# Altium schematic sheet Banks_13_14.SchDoc: FPGA Motherboard for Digital Multiplexed Readout, McGill U.
size B; DocumentNumber: DfMUX8; Revision: Rev0, Prototype; SheetNumber: 8; SheetTotal: 27; PageSetup: Record=PageOptions|CenterHorizontal=True|CenterVertical=True|PrintScale=1.08|XCorrection=1.00|YCorrection=1.00|PrintKind=0|BorderSize=5000000|LeftOffset=0|BottomOffset=0|Orientation=2|PaperLength=1000|PaperWidth=1000|Scale=100|PaperSource=7|PrintQuality=-4|MediaType=1|DitherType=10|PaperKind=Tabloid|PrintScaleMode=1
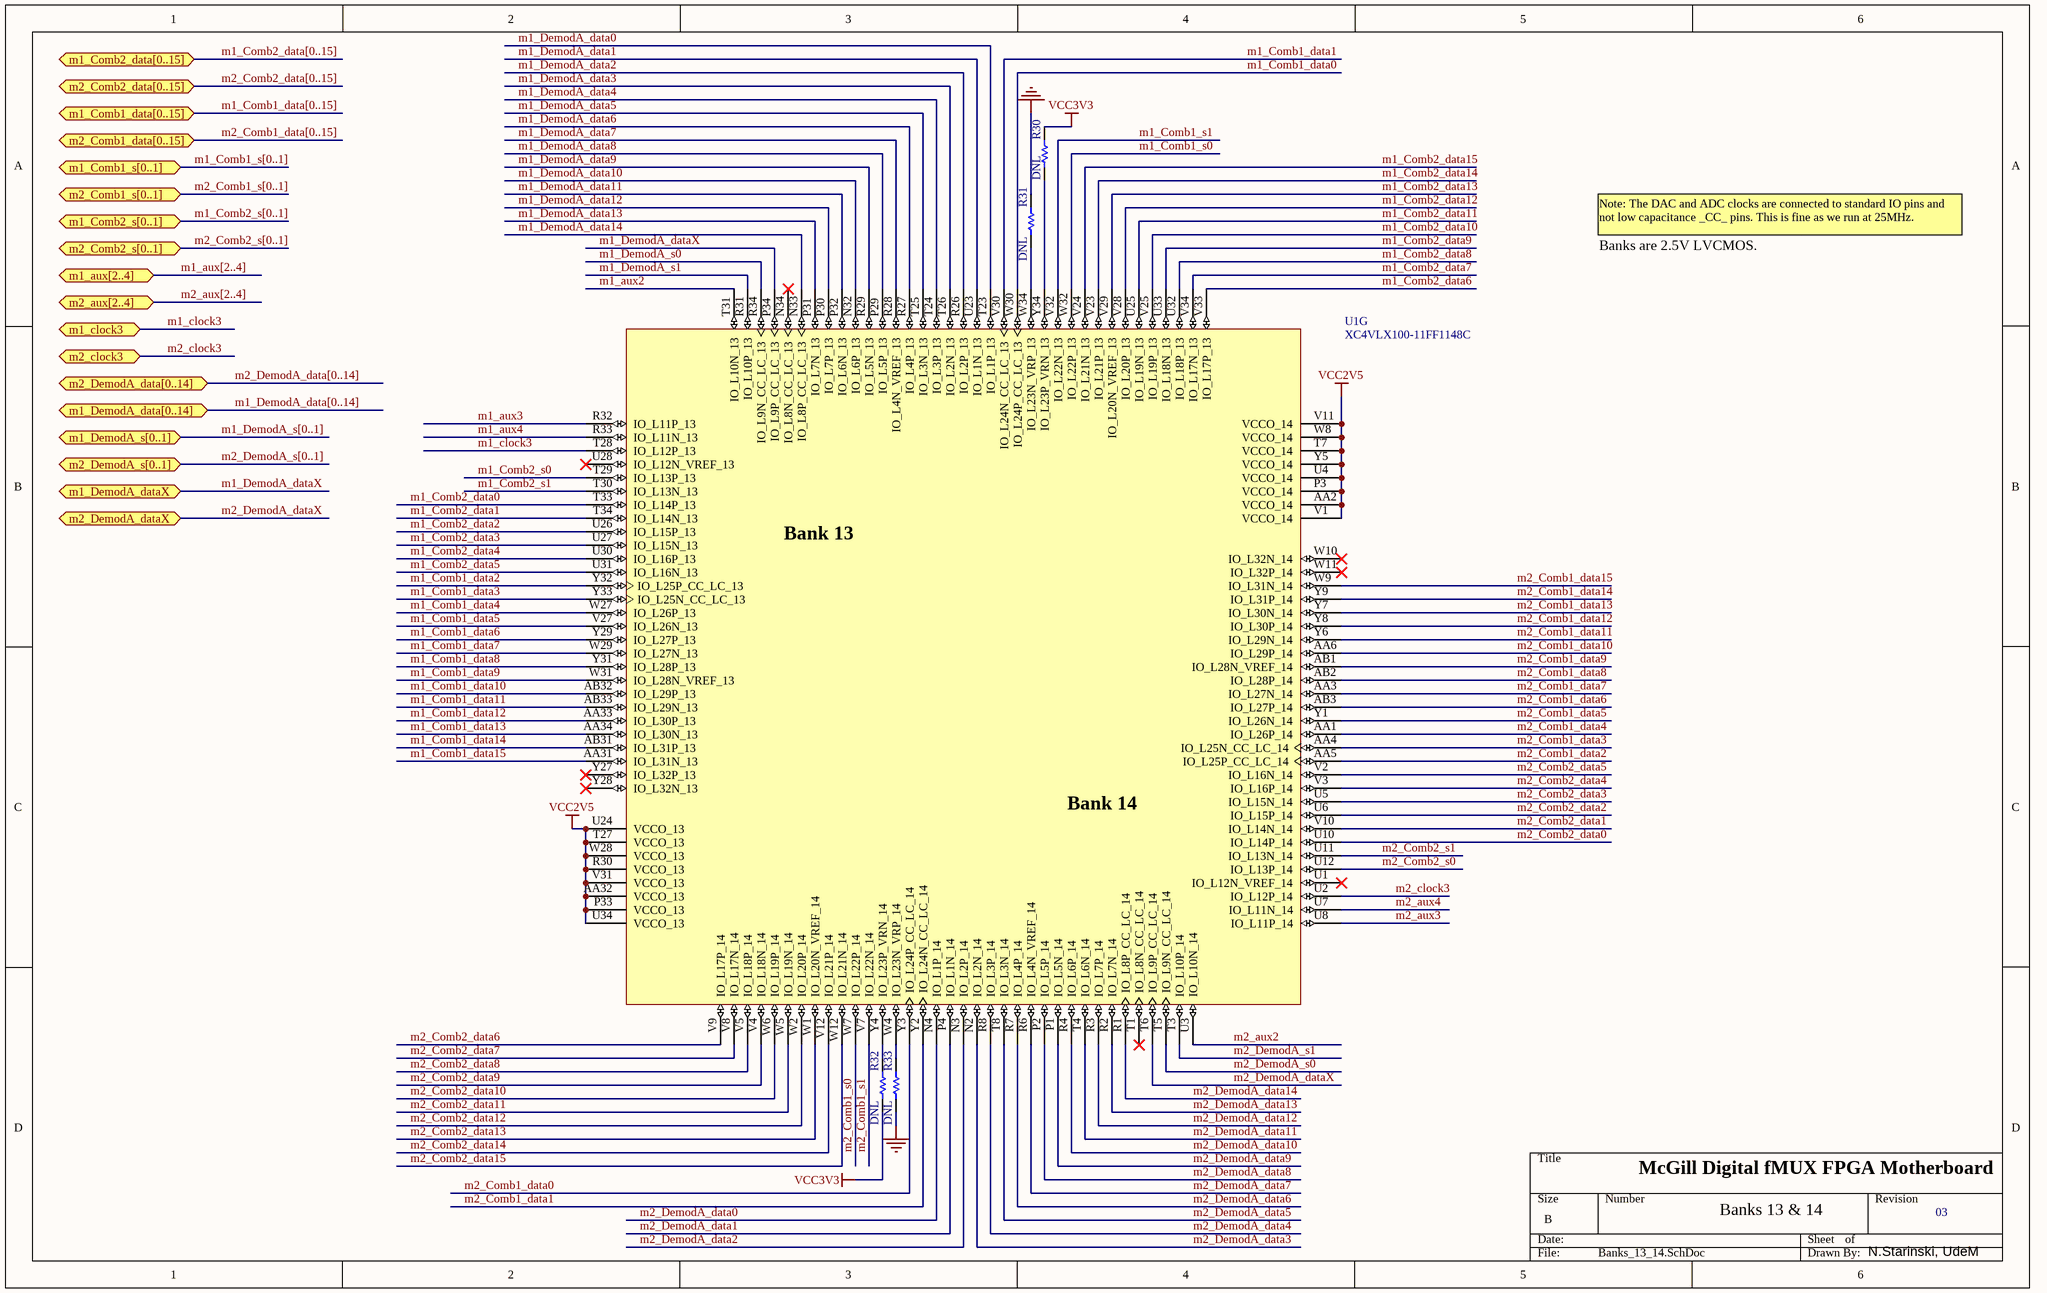
[diagram p0: Banks_13_14.SchDoc]

## Parts
R30  DNL  [CR1608-0603]
R31  DNL  [CR1608-0603]
R32  DNL  [CR1608-0603]
R33  DNL  [CR1608-0603]
U1  XC4VLX100-11FF1148C  [FF1148]  (part G of 10)

## Ports
m1_aux[2..4] (bidir), m1_clock3 (bidir), m1_Comb1_data[0..15] (bidir), m1_Comb1_s[0..1] (bidir), m1_Comb2_data[0..15] (bidir), m1_Comb2_s[0..1] (bidir), m1_DemodA_data[0..14] (bidir), m1_DemodA_dataX (bidir), m1_DemodA_s[0..1] (bidir), m2_aux[2..4] (bidir), m2_clock3 (bidir), m2_Comb1_data[0..15] (bidir), m2_Comb1_s[0..1] (bidir), m2_Comb2_data[0..15] (bidir), m2_Comb2_s[0..1] (bidir), m2_DemodA_data[0..14] (bidir), m2_DemodA_dataX (bidir), m2_DemodA_s[0..1] (bidir)

## Nets
GND: R31.2 R33.1
VCC2V5: U1.AA2(VCCO_14) U1.AA32(VCCO_13) U1.P3(VCCO_14) U1.P33(VCCO_13) U1.R30(VCCO_13) U1.T7(VCCO_14) U1.T27(VCCO_13) U1.U4(VCCO_14) U1.U24(VCCO_13) U1.U34(VCCO_13) U1.V1(VCCO_14) U1.V11(VCCO_14) U1.V31(VCCO_13) U1.W8(VCCO_14) U1.W28(VCCO_13) U1.Y5(VCCO_14)
VCC3V3: R30.2 R32.1
m1_aux2: U1.T31(IO_L10N_13)
m1_aux3: U1.R32(IO_L11P_13)
m1_aux4: U1.R33(IO_L11N_13)
m1_clock3: U1.T28(IO_L12P_13) ; port m1_clock3
m1_Comb1_data0: U1.W30(IO_L24P_CC_LC_13)
m1_Comb1_data1: U1.V30(IO_L24N_CC_LC_13)
m1_Comb1_data2: U1.Y32(IO_L25P_CC_LC_13)
m1_Comb1_data3: U1.Y33(IO_L25N_CC_LC_13)
m1_Comb1_data4: U1.W27(IO_L26P_13)
m1_Comb1_data5: U1.V27(IO_L26N_13)
m1_Comb1_data6: U1.Y29(IO_L27P_13)
m1_Comb1_data7: U1.W29(IO_L27N_13)
m1_Comb1_data8: U1.Y31(IO_L28P_13)
m1_Comb1_data9: U1.W31(IO_L28N_VREF_13)
m1_Comb1_data10: U1.AB32(IO_L29P_13)
m1_Comb1_data11: U1.AB33(IO_L29N_13)
m1_Comb1_data12: U1.AA33(IO_L30P_13)
m1_Comb1_data13: U1.AA34(IO_L30N_13)
m1_Comb1_data14: U1.AB31(IO_L31P_13)
m1_Comb1_data15: U1.AA31(IO_L31N_13)
m1_Comb1_s0: U1.W32(IO_L22P_13)
m1_Comb1_s1: U1.V32(IO_L22N_13)
m1_Comb2_data0: U1.T33(IO_L14P_13)
m1_Comb2_data1: U1.T34(IO_L14N_13)
m1_Comb2_data2: U1.U26(IO_L15P_13)
m1_Comb2_data3: U1.U27(IO_L15N_13)
m1_Comb2_data4: U1.U30(IO_L16P_13)
m1_Comb2_data5: U1.U31(IO_L16N_13)
m1_Comb2_data6: U1.V33(IO_L17P_13)
m1_Comb2_data7: U1.V34(IO_L17N_13)
m1_Comb2_data8: U1.U32(IO_L18P_13)
m1_Comb2_data9: U1.U33(IO_L18N_13)
m1_Comb2_data10: U1.V25(IO_L19P_13)
m1_Comb2_data11: U1.U25(IO_L19N_13)
m1_Comb2_data12: U1.V28(IO_L20P_13)
m1_Comb2_data13: U1.V29(IO_L20N_VREF_13)
m1_Comb2_data14: U1.V23(IO_L21P_13)
m1_Comb2_data15: U1.V24(IO_L21N_13)
m1_Comb2_s0: U1.T29(IO_L13P_13)
m1_Comb2_s1: U1.T30(IO_L13N_13)
m1_DemodA_data0: U1.T23(IO_L1P_13)
m1_DemodA_data1: U1.U23(IO_L1N_13)
m1_DemodA_data2: U1.R26(IO_L2P_13)
m1_DemodA_data3: U1.T26(IO_L2N_13)
m1_DemodA_data4: U1.T24(IO_L3P_13)
m1_DemodA_data5: U1.T25(IO_L3N_13)
m1_DemodA_data6: U1.R27(IO_L4P_13)
m1_DemodA_data7: U1.R28(IO_L4N_VREF_13)
m1_DemodA_data8: U1.P29(IO_L5P_13)
m1_DemodA_data9: U1.R29(IO_L5N_13)
m1_DemodA_data10: U1.N32(IO_L6P_13)
m1_DemodA_data11: U1.P32(IO_L6N_13)
m1_DemodA_data12: U1.P30(IO_L7P_13)
m1_DemodA_data13: U1.P31(IO_L7N_13)
m1_DemodA_data14: U1.N33(IO_L8P_CC_LC_13)
m1_DemodA_dataX: U1.P34(IO_L9P_CC_LC_13) ; port m1_DemodA_dataX
m1_DemodA_s0: U1.R34(IO_L9N_CC_LC_13)
m1_DemodA_s1: U1.R31(IO_L10P_13)
m2_aux2: U1.U3(IO_L10N_14)
m2_aux3: U1.U8(IO_L11P_14)
m2_aux4: U1.U7(IO_L11N_14)
m2_clock3: U1.U2(IO_L12P_14) ; port m2_clock3
m2_Comb1_data0: U1.Y3(IO_L24P_CC_LC_14)
m2_Comb1_data1: U1.Y2(IO_L24N_CC_LC_14)
m2_Comb1_data2: U1.AA5(IO_L25P_CC_LC_14)
m2_Comb1_data3: U1.AA4(IO_L25N_CC_LC_14)
m2_Comb1_data4: U1.AA1(IO_L26P_14)
m2_Comb1_data5: U1.Y1(IO_L26N_14)
m2_Comb1_data6: U1.AB3(IO_L27P_14)
m2_Comb1_data7: U1.AA3(IO_L27N_14)
m2_Comb1_data8: U1.AB2(IO_L28P_14)
m2_Comb1_data9: U1.AB1(IO_L28N_VREF_14)
m2_Comb1_data10: U1.AA6(IO_L29P_14)
m2_Comb1_data11: U1.Y6(IO_L29N_14)
m2_Comb1_data12: U1.Y8(IO_L30P_14)
m2_Comb1_data13: U1.Y7(IO_L30N_14)
m2_Comb1_data14: U1.Y9(IO_L31P_14)
m2_Comb1_data15: U1.W9(IO_L31N_14)
m2_Comb1_s0: U1.W7(IO_L22P_14)
m2_Comb1_s1: U1.V7(IO_L22N_14)
m2_Comb2_data0: U1.U10(IO_L14P_14)
m2_Comb2_data1: U1.V10(IO_L14N_14)
m2_Comb2_data2: U1.U6(IO_L15P_14)
m2_Comb2_data3: U1.U5(IO_L15N_14)
m2_Comb2_data4: U1.V3(IO_L16P_14)
m2_Comb2_data5: U1.V2(IO_L16N_14)
m2_Comb2_data6: U1.V9(IO_L17P_14)
m2_Comb2_data7: U1.V8(IO_L17N_14)
m2_Comb2_data8: U1.V5(IO_L18P_14)
m2_Comb2_data9: U1.V4(IO_L18N_14)
m2_Comb2_data10: U1.W6(IO_L19P_14)
m2_Comb2_data11: U1.W5(IO_L19N_14)
m2_Comb2_data12: U1.W2(IO_L20P_14)
m2_Comb2_data13: U1.W1(IO_L20N_VREF_14)
m2_Comb2_data14: U1.V12(IO_L21P_14)
m2_Comb2_data15: U1.W12(IO_L21N_14)
m2_Comb2_s0: U1.U12(IO_L13P_14)
m2_Comb2_s1: U1.U11(IO_L13N_14)
m2_DemodA_data0: U1.N4(IO_L1P_14)
m2_DemodA_data1: U1.P4(IO_L1N_14)
m2_DemodA_data2: U1.N3(IO_L2P_14)
m2_DemodA_data3: U1.N2(IO_L2N_14)
m2_DemodA_data4: U1.R8(IO_L3P_14)
m2_DemodA_data5: U1.T8(IO_L3N_14)
m2_DemodA_data6: U1.R7(IO_L4P_14)
m2_DemodA_data7: U1.R6(IO_L4N_VREF_14)
m2_DemodA_data8: U1.P2(IO_L5P_14)
m2_DemodA_data9: U1.P1(IO_L5N_14)
m2_DemodA_data10: U1.R4(IO_L6P_14)
m2_DemodA_data11: U1.T4(IO_L6N_14)
m2_DemodA_data12: U1.R3(IO_L7P_14)
m2_DemodA_data13: U1.R2(IO_L7N_14)
m2_DemodA_data14: U1.R1(IO_L8P_CC_LC_14)
m2_DemodA_dataX: U1.T6(IO_L9P_CC_LC_14) ; port m2_DemodA_dataX
m2_DemodA_s0: U1.T5(IO_L9N_CC_LC_14)
m2_DemodA_s1: U1.T3(IO_L10P_14)
NetR30_1: R30.1 U1.Y34(IO_L23P_VRN_13)
NetR31_1: R31.1 U1.W34(IO_L23N_VRP_13)
NetR32_2: R32.2 U1.Y4(IO_L23P_VRN_14)
NetR33_2: R33.2 U1.W4(IO_L23N_VRP_14)

Not connected (* = marked no-connect by the designer): U1 N34(IO_L8N_CC_LC_13)* T1(IO_L8N_CC_LC_14)* U1(IO_L12N_VREF_14)* U28(IO_L12N_VREF_13)* W10(IO_L32N_14)* W11(IO_L32P_14)* Y27(IO_L32P_13)* Y28(IO_L32N_13)*

## Buses and harness runs
bus m1_aux[2..4] = port m1_aux[2..4]
bus m1_Comb1_data[0..15] = port m1_Comb1_data[0..15]
bus m1_Comb1_s[0..1] = port m1_Comb1_s[0..1]
bus m1_Comb2_data[0..15] = port m1_Comb2_data[0..15]
bus m1_Comb2_s[0..1] = port m1_Comb2_s[0..1]
bus m1_DemodA_data[0..14] = port m1_DemodA_data[0..14]
bus m1_DemodA_s[0..1] = port m1_DemodA_s[0..1]
bus m2_aux[2..4] = port m2_aux[2..4]
bus m2_Comb1_data[0..15] = port m2_Comb1_data[0..15]
bus m2_Comb1_s[0..1] = port m2_Comb1_s[0..1]
bus m2_Comb2_data[0..15] = port m2_Comb2_data[0..15]
bus m2_Comb2_s[0..1] = port m2_Comb2_s[0..1]
bus m2_DemodA_data[0..14] = port m2_DemodA_data[0..14]
bus m2_DemodA_s[0..1] = port m2_DemodA_s[0..1]

## Notes on the sheet
- Note: The DAC and ADC clocks are connected to standard IO pins and not low capacitance _CC_ pins. This is fine as we run at 25MHz.
- Banks are 2.5V LVCMOS.
- McGill Digital fMUX FPGA Motherboard
- Banks 13 & 14
- 03
- N.Starinski, UdeM
- (in symbol XC4VLX100-11FF1148C, part G) Bank 13; Bank 14

## Library data of the parts
R30-R33 = Res Semi: Semiconductor Resistor; Published: 8-Jun-2000; LatestRevisionDate: 17-Jul-2002; LatestRevisionNote: Re-released for DXP Platform.; Publisher: Altium Limited
U1 = XC4VLX100-11FF1148C: Xilinx Virtex-4 LX Platform FPGA, 1148-Ball FFBGA, Speed Grade 11, 768 User I/Os, Commercial Grade; PackageDocument: ver1.0, Oct-2002; Published: 13-Dec-2004; LatestRevisionDate: 4-Mar-2005; LatestRevisionNote: D_IN & CS_B pins changed from I/O to Input. DOUT_BUSY pin changed from I/O to Output.; DatasheetDocument: ver1.2, Dec-2004; PackageReference: FF1148; Publisher: Altium Limited; ComponentLink2Description: Virtex-4 Overview; ComponentLink2URL: http://www.xilinx.com/products/virtex4/overview.htm; ComponentLink3Description: Datasheet; ComponentLink3URL: http://direct.xilinx.com/bvdocs/userguides/ug075.pdf; Code_JEDEC: MS-034-AAR-1